# EAGLE schematic amp_schematic_eagle (EAGLE 6.5.0)
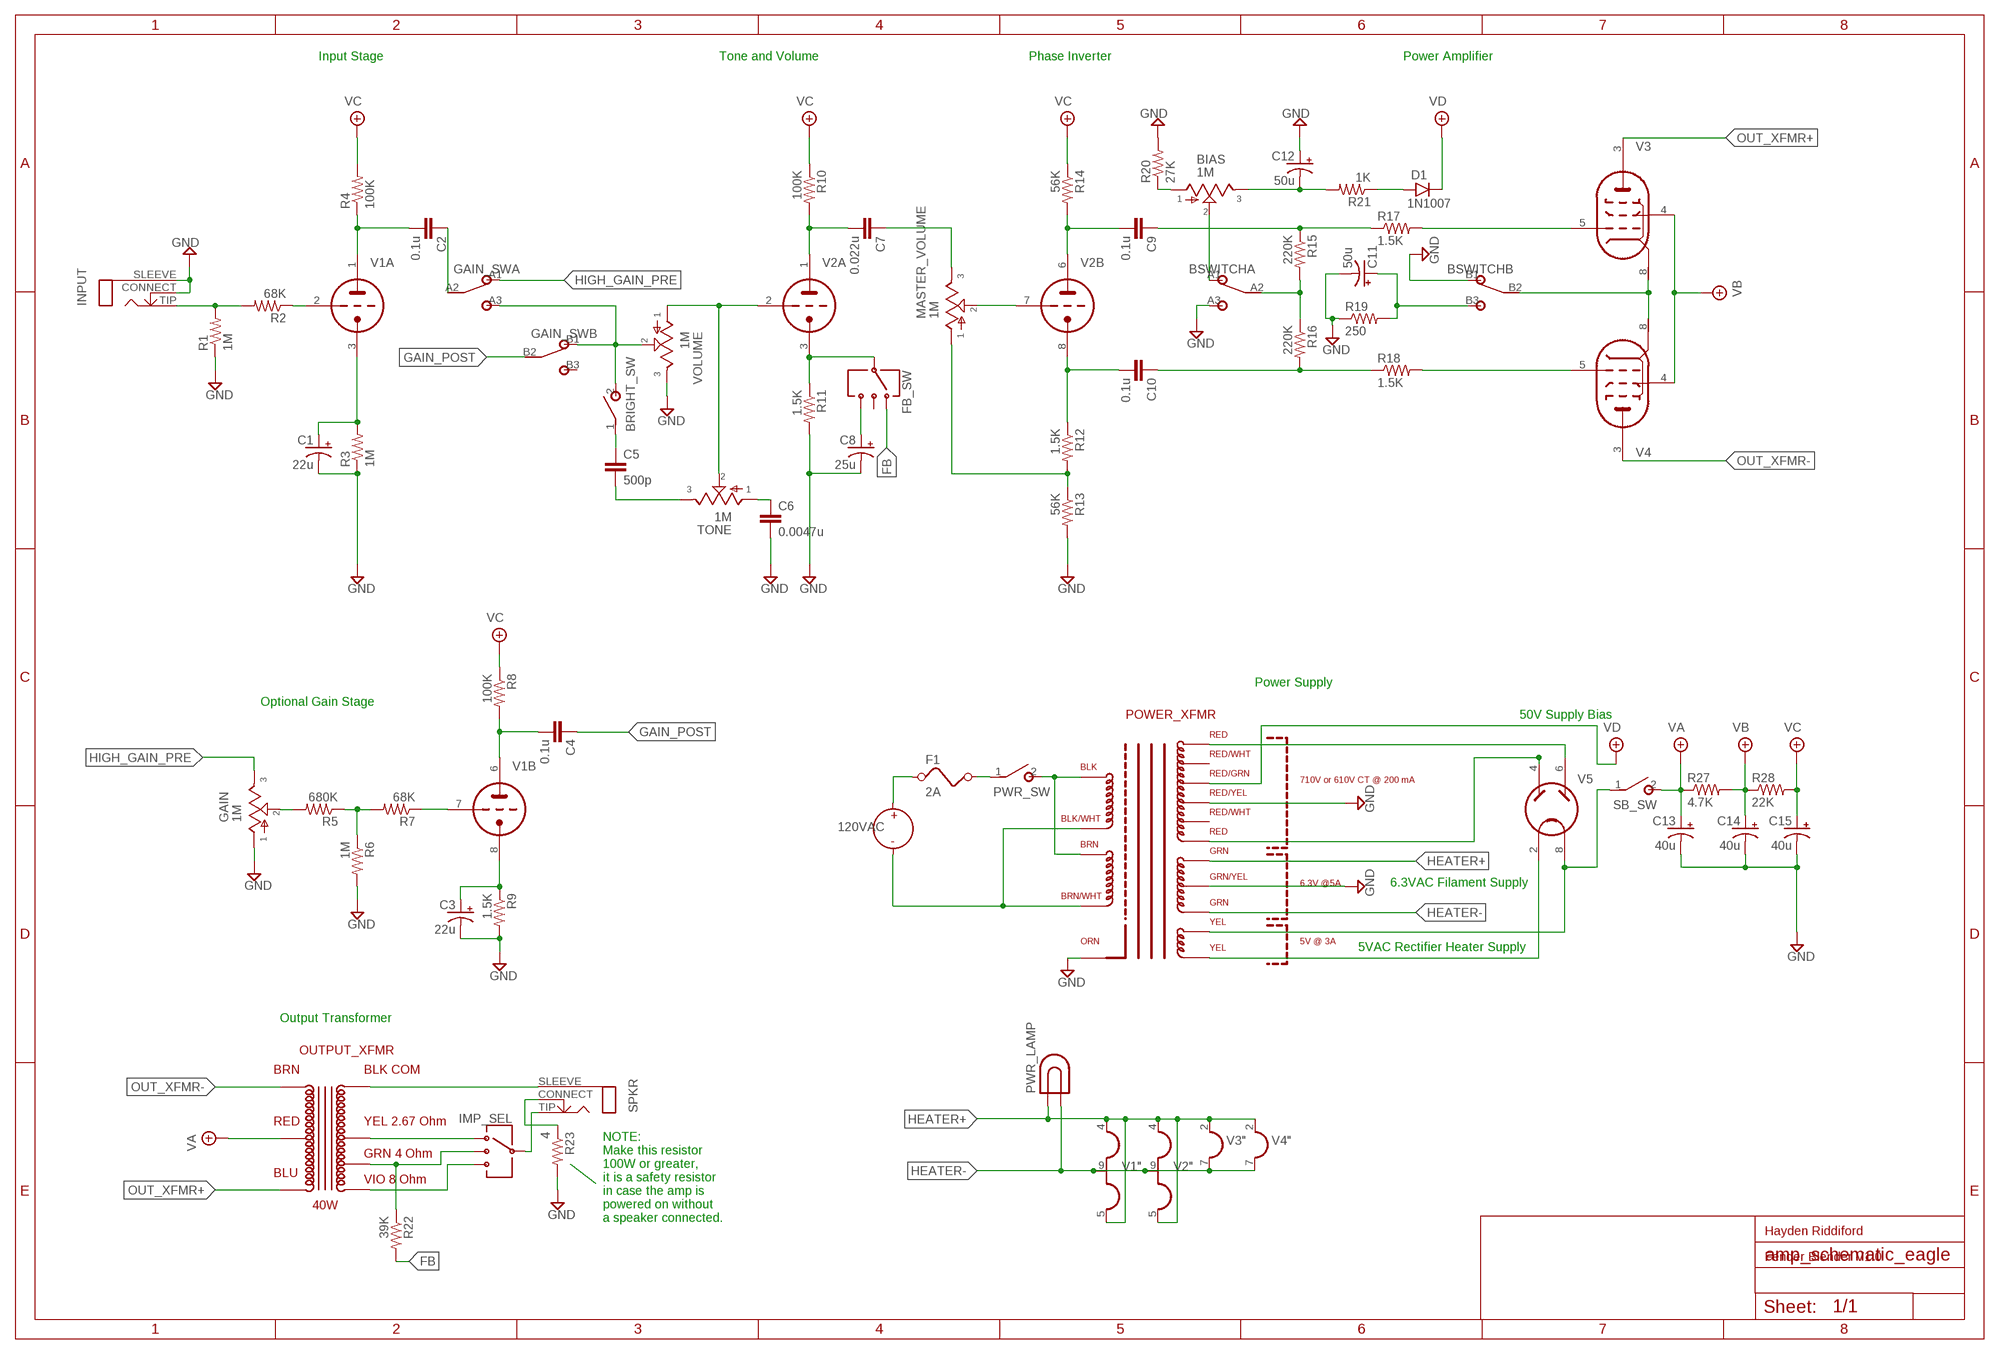
[diagram p0: schematic, sheet 1]

## Parts
BIAS  1M  POT  [POT]
BRIGHT_SW  SPST  [SPST]
BSWITCH  DPDT  [DPDT]
C1  22u  0504  [050_020_4]
C2  0.1u  050X030_0254  [050X030_025_4]
C3  22u  0504  [050_020_4]
C4  0.1u  050X030_0254  [050X030_025_4]
C5  500p  050X030_0254  [050X030_025_4]
C6  0.0047u  050X030_0254  [050X030_025_4]
C7  0.022u  050X030_0254  [050X030_025_4]
C8  25u  0504  [050_020_4]
C9  0.1u  050X030_0254  [050X030_025_4]
C10  0.1u  050X030_0254  [050X030_025_4]
C11  50u  0504  [050_020_4]
C12  50u  0504  [050_020_4]
C13  40u  0504  [050_020_4]
C14  40u  0504  [050_020_4]
C15  40u  0504  [050_020_4]
D1  1N1007  DO07  [DO07]
F1  2A  FUSE  [FUSE]
FB_SW  SWITCH-SP3T  [SWITCH-SP3T-SMD]
GAIN  1M  POT  [POT]
GAIN_SW  DPDT  [DPDT]
IMP_SEL  SWITCH-SP3T  [SWITCH-SP3T-SMD]
INPUT  CLOSEDMONO  [CLOSED_MONO_JACK]
MASTER_VOLUME  1M  POT  [POT]
OUTPUT_XFMR  CLASSIC_TONE_40-18088  [CLASSIC_TONE_40-18088]
POWER_XFMR  CLASSIC_TONE_40-18094  [CLASSIC_TONE_40-18094]
PWR_LAMP  LAMP  [LDH-5R]
PWR_SW  SPST  [SPST]
R1  1M  6MM.2  [R0207/2V]
R2  68K  6MM.2  [R0207/2V]
R3  1M  6MM.2  [R0207/2V]
R4  100K  6MM.2  [R0207/2V]
R5  680K  6MM.2  [R0207/2V]
R6  1M  6MM.2  [R0207/2V]
R7  68K  6MM.2  [R0207/2V]
R8  100K  6MM.2  [R0207/2V]
R9  1.5K  6MM.2  [R0207/2V]
R10  100K  6MM.2  [R0207/2V]
R11  1.5K  6MM.2  [R0207/2V]
R12  1.5K  6MM.2  [R0207/2V]
R13  56K  6MM.2  [R0207/2V]
R14  56K  6MM.2  [R0207/2V]
R15  220K  6MM.2  [R0207/2V]
R16  220K  6MM.2  [R0207/2V]
R17  1.5K  6MM.2  [R0207/2V]
R18  1.5K  6MM.2  [R0207/2V]
R19  250  6MM.2  [R0207/2V]
R20  27K  6MM.2  [R0207/2V]
R21  1K  6MM.2  [R0207/2V]
R22  39K  6MM.2  [R0207/2V]
R23  4  6MM.2  [R0207/2V]
R27  4.7K  6MM.2  [R0207/2V]
R28  22K  6MM.2  [R0207/2V]
SB_SW  SPST  [SPST]
SPKR  CLOSEDMONO  [CLOSED_MONO_JACK]
TONE  1M  POT  [POT]
V1  12AX7-P  [NOVAL]
V2  12AX7-P  [NOVAL]
V3  6V6GT-P  [OKTAL]
V4  6V6GT-P  [OKTAL]
V5  5Y3GT  [OKTAL]
VOLUME  1M  POT  [POT]

## Nets
ANODE: F1.1 ; supply symbol labelled V
BLK_COM: OUTPUT_XFMR.P$4 SPKR.SLEEVE(RING)
FB: FB_SW.1 R22.2
GAIN_POST: C4.1 GAIN_SW.B2
GND: BSWITCH.A3 BSWITCH.B1 C1.- C3.- C6.2 C8.- C11.- C12.+ C13.- C14.- C15.- GAIN.1 INPUT.CONNECT INPUT.SLEEVE(RING) POWER_XFMR.P$8 POWER_XFMR.P$12 POWER_XFMR.P$16 R1.1 R3.1 R6.2 R9.2 R11.2 R13.2 R19.1 R20.2 R23.2 VOLUME.3
HEATER+: POWER_XFMR.P$11 PWR_LAMP.1 V1.4(":H1) V1.5(":H3) V2.4(":H1) V2.5(":H3) V3.2(H1) V4.2(H1)
HEATER-: POWER_XFMR.P$13 PWR_LAMP.2 V1.9(":H2) V2.9(":H2) V3.7(H2) V4.7(H2)
HIGH_GAIN_PRE: GAIN.3 GAIN_SW.A1
N$1: R2.1 V1.2(A:TG)
N$2: INPUT.TIP R1.2 R2.2
N$3: C1.+ R3.2 V1.3(A:TK)
N$4: C2.2 R4.1 V1.1(A:TA)
N$5: C2.1 GAIN_SW.A2
N$6: GAIN.2 R5.2
N$7: R5.1 R6.1 R7.2
N$8: C3.+ R9.1 V1.8(B:TK)
N$9: C4.2 R8.2 V1.6(B:TA)
N$10: R7.1 V1.7(B:TG)
N$11: BRIGHT_SW.1(P) C5.1
N$12: C5.2 TONE.3
N$13: TONE.2 V2.2(A:TG) VOLUME.1
N$14: C6.1 TONE.1
N$15: C7.2 R10.2 V2.1(A:TA)
N$16: FB_SW.3 R11.1 V2.3(A:TK)
N$17: C8.+ FB_SW.4
N$18: MASTER_VOLUME.2 V2.7(B:TG)
N$19: MASTER_VOLUME.1 R12.2 R13.1
N$20: C10.2 R12.1 V2.8(B:TK)
N$21: C9.2 R14.2 V2.6(B:TA)
N$22: F1.2 PWR_SW.1(P)
N$23: R23.1 SPKR.CONNECT
N$24: IMP_SEL.2 OUTPUT_XFMR.P$6 R22.1
N$25: BSWITCH.B2 V3.8(PK) V4.8(PK)
N$27: BIAS.2 BSWITCH.A1
N$28: D1.A R21.1
N$29: R17.2 V3.5(PG)
N$30: R18.2 V4.5(PG)
N$31: BIAS.3 C12.- R21.2
N$32: BIAS.1 R20.1
N$33: IMP_SEL.3 SPKR.TIP
N$34: POWER_XFMR.P$5 V5.6(A2)
N$35: BSWITCH.A2 R15.2 R16.1
N$36: BSWITCH.B3 C11.+ R19.2
NORMAL_PRE: BRIGHT_SW.2(S) GAIN_SW.A3 GAIN_SW.B1 VOLUME.2
OUT_XFMR+: OUTPUT_XFMR.P$3 V3.3(PA)
OUT_XFMR-: OUTPUT_XFMR.P$1 V4.3(PA)
PA+: C9.1 R15.1 R17.1
PA-: C10.1 R16.2 R18.1
PHASE_INV: C7.1 MASTER_VOLUME.3
PWR_BLK: POWER_XFMR.P$1 POWER_XFMR.P$3 PWR_SW.2(S)
PWR_BRN_WHT: POWER_XFMR.P$2 POWER_XFMR.P$4 ; supply symbol labelled V
PWR_GRN: POWER_XFMR.P$10 V5.4(A1)
PWR_YEL: POWER_XFMR.P$14 SB_SW.1(P) V5.8(H2)
PWR_YEL2: POWER_XFMR.P$15 V5.2(H1)
VA: C13.+ OUTPUT_XFMR.P$2 R27.1 SB_SW.2(S)
VB: C14.+ R27.2 R28.1 V3.4(PSG) V4.4(PSG)
VC: C15.+ R4.2 R8.1 R10.1 R14.1 R28.2
VD: D1.C POWER_XFMR.P$7
VIO_8OHM: IMP_SEL.4 OUTPUT_XFMR.P$7
YEL_2P67OHM: IMP_SEL.1 OUTPUT_XFMR.P$5
Unconnected: FB_SW.2 GAIN_SW.B3 POWER_XFMR.P$6 POWER_XFMR.P$9

## Notes on the sheet
- Input Stage | Tone and Volume | Phase Inverter | Power Amplifier
- Power Supply
- Optional Gain Stage
- 50V Supply Bias
- 6.3VAC Filament Supply
- 5VAC Rectifier Heater Supply
- Output Transformer
- NOTE:
  Make this resistor
  100W or greater,
  it is a safety resistor
  in case the amp is
  powered on without
  a speaker connected.
- Fender Blender V1.0

## Library data of the parts
BIAS GAIN MASTER_VOLUME TONE VOLUME = gm-pots:POT: Potentiometers the arrow indicates the clockwise motion of th wiper (lug 2) fully counter clockwise there is no resistance between lugs 1 and 2 fully clockwise the resistance between lugs 1 and 2 is the value of the pot
BRIGHT_SW PWR_SW SB_SW = gm-switches:SPST
BSWITCH GAIN_SW = gm-switches:DPDT
C1 C3 C8 C11-C15 = gm-caps-electro-pol:050: 0.22 - 100uF Xicon values at Mouser.com: 10V: 10 - 100uF; 16V: 2.2 - 47uF; 25V: 0.47 - 47uF; 50V: 0.22 - 22uF
C2 C4-C7 C9 C10 = gm-caps-ceramic:050X030_025: 47 - 120pF Xicon Ceramic Disc 2.5mm lead spacing
D1 = gm-diodes:DO07: DO-07 Package for 1N34A and similar Ge diodes
F1 = special:FUSE: FUSE 5 x 20 mm
FB_SW IMP_SEL = SparkFun-Electromechanical:SWITCH-SP3T
INPUT SPKR = gm-jacks:CLOSEDMONO: Closed Mono 1/4" Phone Jack
OUTPUT_XFMR = OutputXFMR:CLASSIC_TONE_40-18088
POWER_XFMR = PowerXFMR:CLASSIC_TONE_40-18094
PWR_LAMP = special:LAMP: LED HOLDER
R1-R23 R27 R28 = gm-resistors:6MM: 6mm Resistors Leads spaced 1-6 holes apart for 0.1" perfboard. Suitable for 1/4 watt resistors.
V1 V2 = tubes:12AX7-P
V3 V4 = tubes:6V6GT-P
V5 = tubes:5Y3GT